# Altium schematic sheet Ada - Base Block - Daughter Board 4.0.SchDoc: Title
size A3; DrawnBy: Name; DocumentNumber: 2; Revision: A; SheetNumber: 2; SheetTotal: 4
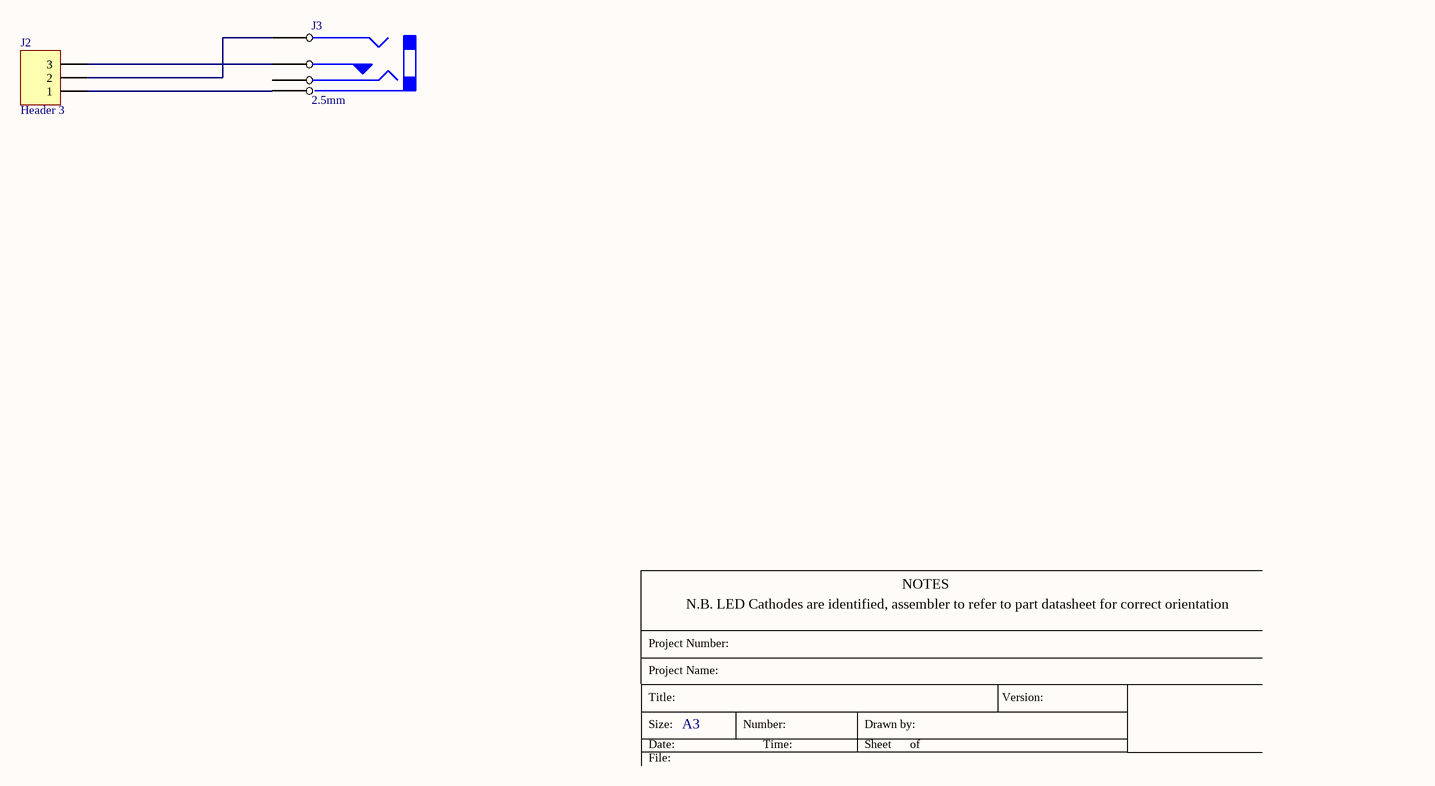
[diagram p0: Ada - Base Block - Daughter Board 4.0.SchDoc]

## Parts
J2  Header 3  [sip3]
J3  value 2.5mm  [2.5mm socket TRI001]  (hidden comment: 2.5mm PHONEJACK STEREO TRI001)

## Nets
NetJ2_1: J2.1 J3.1
NetJ2_2: J2.2 J3.4
NetJ2_3: J2.3 J3.2

Not connected (* = marked no-connect by the designer): J3 3

## Notes on the sheet
- N.B. LED Cathodes are identified, assembler to refer to part datasheet for correct orientation
- NOTES
- Project Name:
- Project Number:
- Title:
- Size:
- Date:
- A3
- Number:
- Time:
- Sheet
- Drawn by:
- of
- Version:
- File:

## Library data of the parts
J2 = Header 3: Header, 3-Pin; Value: Daughter Board Con
J3 = 2.5mm PHONEJACK STEREO TRI001: 2.5mm PHONEJACK STEREO; Manufacturer: PRO SIGNAL; Manuf Part #: PSG01539; FEC#: 1280745; Part No.: 1280745; Supplier: FEC